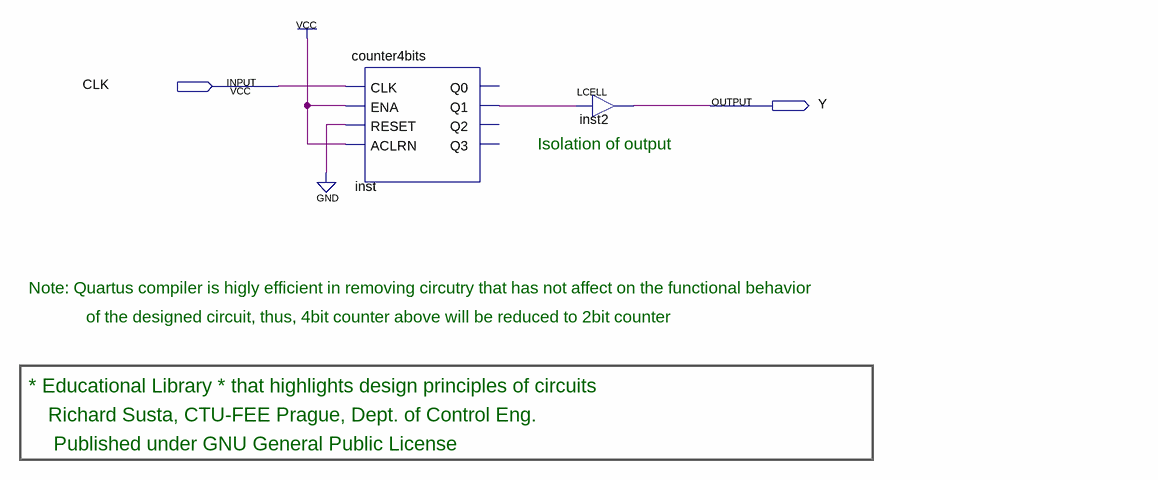
[diagram p0: schematic sheet]
// Quartus schematic divider4.bdf as structural Verilog: 2 symbols, 2 pins
module divider4 (
  input  CLK,
  output Y
);

  wire inst_q1;

  counter4bits inst (.CLK(CLK), .ENA(1'b1), .RESET(1'b0), .ACLRN(1'b1), .Q1(inst_q1));  // open: Q0, Q2, Q3
  LCELL inst2 (.IN(inst_q1), .OUT(Y));

  // Notes on the sheet:
  //   Isolation of output
  //   Note: Quartus compiler is higly efficient in removing circutry that has not affect on the functional behavior
  //   of the designed circuit, thus, 4bit counter above will be reduced to 2bit counter
  //   * Educational Library * that highlights design principles of circuits
  //   Richard Susta, CTU-FEE Prague, Dept. of Control Eng. 
  //    Published under GNU General Public License
endmodule
